# EAGLE design RPI4Soar_V1 (EAGLE 9.6.2)
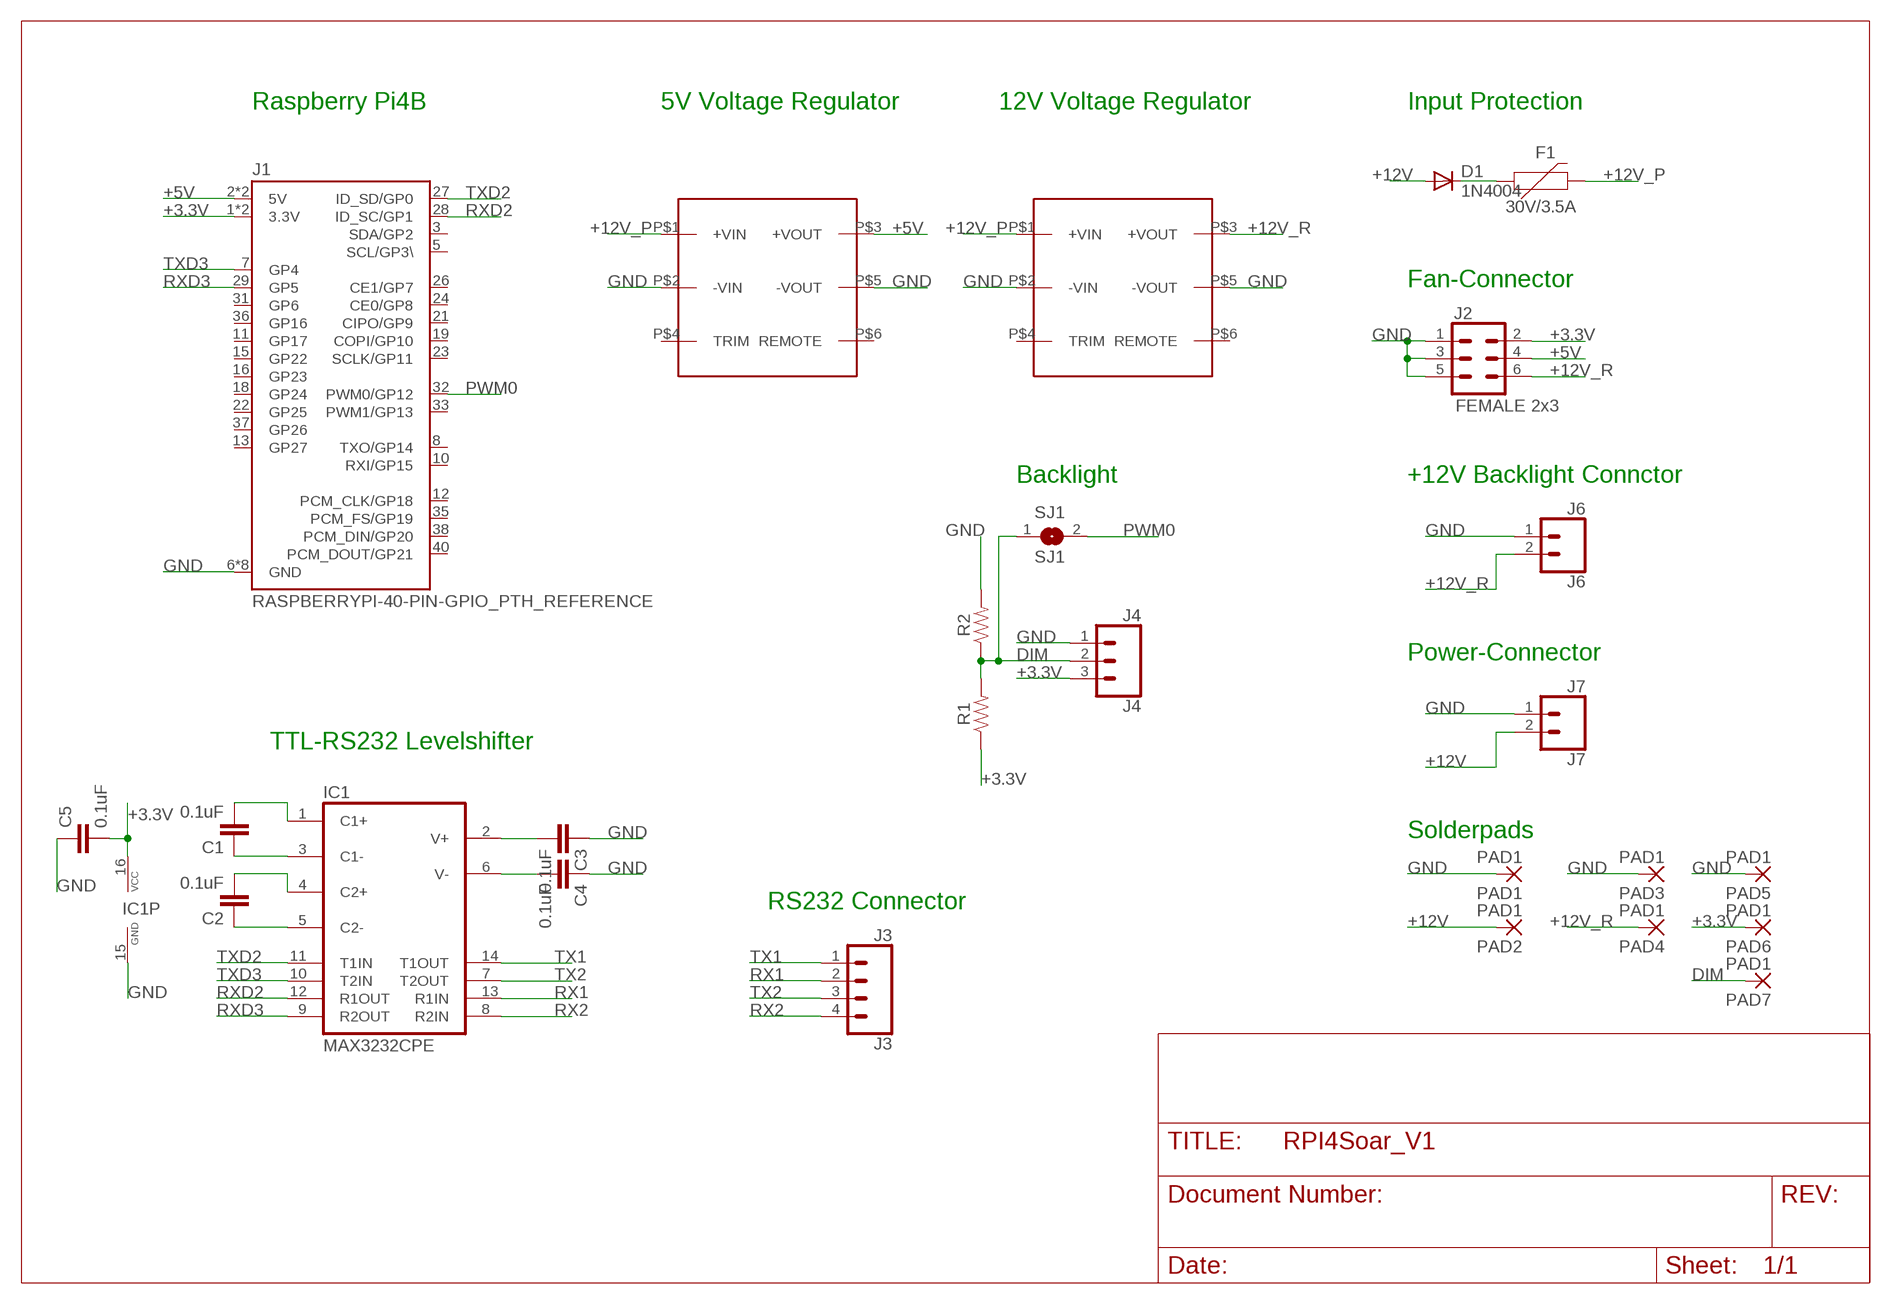
[diagram p0: schematic, sheet 1]

## Parts
C1  0.1uF  0.1UF-KIT-EZ-50V-20%  [CAP-PTH-SMALL-KIT]
C2  0.1uF  0.1UF-KIT-EZ-50V-20%  [CAP-PTH-SMALL-KIT]
C3  0.1uF  0.1UF-KIT-EZ-50V-20%  [CAP-PTH-SMALL-KIT]
C4  0.1uF  0.1UF-KIT-EZ-50V-20%  [CAP-PTH-SMALL-KIT]
C5  0.1uF  0.1UF-KIT-EZ-50V-20%  [CAP-PTH-SMALL-KIT]
D1  1N4004  [DO41-10]
F1  30V/3.5A  PPTC_PTH  [PTH]
IC1  MAX3232CPE  [DIL16]
J1  RASPBERRYPI-40-PIN-GPIO_PTH_REFERENCE  [RASPBERRY_PI_HAT_40_PIN_PTH_WITH_REFERNCE]
J2  FEMALE 2x3  CONN_03X2FEMALE  [2X3]
J3  J3  CONN_04PTH  [1X04]
J4  J4  CONN_03  [1X03]
J6  J6  CONN_02  [1X02]
J7  J7  CONN_02  [1X02]
PAD1  PAD1  SMD5  [SMD2,54-5,08]
PAD2  PAD1  SMD5  [SMD2,54-5,08]
PAD3  PAD1  SMD5  [SMD2,54-5,08]
PAD4  PAD1  SMD5  [SMD2,54-5,08]
PAD5  PAD1  SMD5  [SMD2,54-5,08]
PAD6  PAD1  SMD5  [SMD2,54-5,08]
PAD7  PAD1  SMD5  [SMD2,54-5,08]
R1  RESISTORAXIAL-0.3  [AXIAL-0.3]
R2  RESISTORAXIAL-0.3  [AXIAL-0.3]
SJ1  SJ1  SJ  [SJ]
U$1  TRACO_THN15WI +5V  TRACO_THN15WI  [TRACO_THN15WI]
U$2  TRACO_THN15WI +12V  TRACO_THN15WI  [TRACO_THN15WI]

## Nets
+3.3V: C5.2 IC1.16(VCC) J1.1(3.3V) J1.17(3.3V) J2.2 J4.3 PAD6.1(P) R1.P$1
+5V: J1.2(5V) J1.4(5V) J2.4 U$1.P$3(+VOUT)
+12V: D1.A J7.2 PAD2.1(P)
+12V_P: F1.P$2 U$1.P$1(+VIN) U$2.P$1(+VIN)
+12V_R: J2.6 J6.2 PAD4.1(P) U$2.P$3(+VOUT)
DIM: J4.2 PAD7.1(P) R1.P$2 R2.P$1 SJ1.1
GND: C3.1 C4.1 C5.1 IC1.15(GND) J1.6(GND) J1.9(GND) J1.14(GND) J1.20(GND) J1.25(GND) J1.30(GND) J1.34(GND) J1.39(GND) J2.1 J2.3 J2.5 J4.1 J6.1 J7.1 PAD1.1(P) PAD3.1(P) PAD5.1(P) R2.P$2 U$1.P$2(-VIN) U$1.P$5(-VOUT) U$2.P$2(-VIN) U$2.P$5(-VOUT)
N$2: D1.C F1.P$1
N$3: C2.1 IC1.5(C2-)
N$4: C2.2 IC1.4(C2+)
N$5: C1.1 IC1.3(C1-)
N$6: C1.2 IC1.1(C1+)
N$7: C3.2 IC1.2(V+)
N$8: C4.2 IC1.6(V-)
PWM0: J1.32(PWM0/GP12) SJ1.2
RX1: IC1.13(R1IN) J3.2
RX2: IC1.8(R2IN) J3.4
RXD2: IC1.12(R1OUT) J1.28(ID_SC/GP1)
RXD3: IC1.9(R2OUT) J1.29(GP5)
TX1: IC1.14(T1OUT) J3.1
TX2: IC1.7(T2OUT) J3.3
TXD2: IC1.11(T1IN) J1.27(ID_SD/GP0)
TXD3: IC1.10(T2IN) J1.7(GP4)
Unconnected: J1.3(SDA/GP2) J1.5(SCL/GP3\) J1.8(TXO/GP14) J1.10(RXI/GP15) J1.11(GP17) J1.12(PCM_CLK/GP18) J1.13(GP27) J1.15(GP22) J1.16(GP23) J1.18(GP24) J1.19(COPI/GP10) J1.21(CIPO/GP9) J1.22(GP25) J1.23(SCLK/GP11) J1.24(CE0/GP8) J1.26(CE1/GP7) J1.31(GP6) J1.33(PWM1/GP13) J1.35(PCM_FS/GP19) J1.36(GP16) J1.37(GP26) J1.38(PCM_DIN/GP20) J1.40(PCM_DOUT/GP21) U$1.P$4(TRIM) U$1.P$6(REMOTE) U$2.P$4(TRIM) U$2.P$6(REMOTE)

## Notes on the sheet
- Raspberry Pi4B | 5V Voltage Regulator | 12V Voltage Regulator | Input Protection
- Fan-Connector
- Backlight | +12V Backlight Connctor
- Power-Connector
- TTL-RS232 Levelshifter
- Solderpads
- RS232 Connector

## Library data of the parts
C1-C5 = SparkFun-Capacitors:0.1UF: 0.1µF ceramic capacitors A capacitor is a passive two-terminal electrical component used to store electrical energy temporarily in an electric field.; PROD_ID: CAP-08370
D1 = adafruit:1N4004: DIODE General purpose 1N400x type rectifier (With bigger pads) http://www.ladyada.net/library/pcb/eaglelibrary.html
F1 = SparkFun-Fuses:PPTC: Resettable Fuse PPTC Resettable Fuse. Really a sort of resistor with a polymeric positive temperature coefficient whose resistance increases dramatically with an increase in temperature. When heated by the power passing through the resistance rises causing the current to be limited, protecting the circuit. This is achieved by the transition of the polymer from a crystalline to an amorphous state where the conductive carbon separates breaking the conductive pathways found in the cool crystalline structure. When a PPTC cools back down it resumes conducting letting the circuit turn back on. SparkFun Products: SparkFun RedBoard - Programmed with Arduino <https://www.sparkfun.com/products/12757> Pro Micro - 5V/16MHz <https://www.sparkfun.com/products/12640> Arduino Pro 328 - 5V/16MHz <https://www.sparkfun.com/products/10915> MP3 Trigger <https://www.sparkfun.com/products/13720>; PROD_ID: RES-08490; VALUE: 72V/0.25A
IC1 = maxim:MAX3232*: True RS-232 Transceivers 3.0V to 5.5V, Low-Power up to 1Mbps, Using Four 0.1µF External Capacitors Source: http://pdfserv.maxim-ic.com/en/ds/MAX3222-MAX3241.pdf; MF: MAXIM; MPN: MAX3232CPE+; OC_FARNELL: 9724494; OC_NEWARK: 68K4626; SPICEPREFIX: X
J1 = SparkFun-Connectors:RASPBERRYPI-40-PIN-GPIO: Raspberry Pi GPIO Header 2x20 pin connector, as found on B, B+, A+ models. Both shrouded PTH and SMT versions available. SparkFun Products: GPIO Shrouded Header <https://www.sparkfun.com/products/13054>- PTH SparkFun Pi Wedge (Preassembled) <https://www.sparkfun.com/products/13717>
J2 = SparkFun-Connectors:CONN_03X2: Multi connection point. Often used as Generic Header-pin footprint for 0.1 inch spaced/style header connections You can populate with any combo of single row headers, but if you'd like an exact match, check these: Header - 2x3 (Male, 0.1") <https://www.sparkfun.com/products/12807> (PRT-12807) Header - 2x3 (Female, 0.1") <https://www.sparkfun.com/products/13010> (PRT-13010) 2x3 Pin Shrouded Header <https://www.sparkfun.com/products/10877> (PRT-10877) On any of the 0.1 inch spaced packages, you can populate with these: Break Away Headers - Straight <https://www.sparkfun.com/products/116> (PRT-00116) Break Away Male Headers - Right Angle <https://www.sparkfun.com/products/553> (PRT-00553) Female Headers <https://www.sparkfun.com/products/115> (PRT-00115) Break Away Headers - Machine Pin <https://www.sparkfun.com/products/117> (PRT-00117) Break Away Female Headers - Swiss Machine Pin <https://www.sparkfun.com/products/743> (PRT-00743) Special note: the shrouded connector mates well with our 3x2 ribbon cables: Ribbon Crimp Connector - 6-pin (2x3, Female) <https://www.sparkfun.com/products/10651> (PRT-10651) Ribbon Cable - 6 wire (15ft) <https://www.sparkfun.com/products/10646> (PRT-10646); PROD_ID: CONN-11566
J3 = SparkFun-Connectors:CONN_04: Multi connection point. Often used as Generic Header-pin footprint for 0.1 inch spaced/style header connections On any of the 0.1 inch spaced packages, you can populate with these: Break Away Headers - Straight <https://www.sparkfun.com/products/116> (PRT-00116) Break Away Male Headers - Right Angle <https://www.sparkfun.com/products/553> (PRT-00553) Female Headers <https://www.sparkfun.com/products/115> (PRT-00115) Break Away Headers - Machine Pin <https://www.sparkfun.com/products/117> (PRT-00117) Break Away Female Headers - Swiss Machine Pin <https://www.sparkfun.com/products/743> (PRT-00743) For SCREWTERMINALS and SPRING TERMINALS visit here: Screw Terimnals on SparkFun.com <https://www.sparkfun.com/search/results?term=Screw+Terminals> (5mm/3.5mm/2.54mm spacing) This device is also useful as a general connection point to wire up your design to another part of your project. Our various solder wires solder well into these plated through hole pads. Hook-Up Wire - Assortment (Stranded, 22 AWG) <https://www.sparkfun.com/products/11375> (PRT-11375) Hook-Up Wire - Assortment (Solid Core, 22 AWG) <https://www.sparkfun.com/products/11367> (PRT-11367) View the entire wire category on our website here <https://www.sparkfun.com/categories/141> Special notes: Molex polarized connector foot print use with SKU : PRT-08231 with associated crimp pins and housings. 1MM SMD Version SKU: PRT-10208; PROD_ID: CONN-09696
J4 = SparkFun-Connectors:CONN_03: Multi connection point. Often used as Generic Header-pin footprint for 0.1 inch spaced/style header connections On any of the 0.1 inch spaced packages, you can populate with these: Break Away Headers - Straight <https://www.sparkfun.com/products/116> (PRT-00116) Break Away Male Headers - Right Angle <https://www.sparkfun.com/products/553> (PRT-00553) Female Headers <https://www.sparkfun.com/products/115> (PRT-00115) Break Away Headers - Machine Pin <https://www.sparkfun.com/products/117> (PRT-00117) Break Away Female Headers - Swiss Machine Pin <https://www.sparkfun.com/products/743> (PRT-00743) Stackable Header - 3 Pin (Female, 0.1") <https://www.sparkfun.com/products/13875> (PRT-13875) For SCREWTERMINALS and SPRING TERMINALS visit here: Screw Terimnals on SparkFun.com <https://www.sparkfun.com/search/results?term=Screw+Terminals> (5mm/3.5mm/2.54mm spacing) This device is also useful as a general connection point to wire up your design to another part of your project. Our various solder wires solder well into these plated through hole pads. Hook-Up Wire - Assortment (Stranded, 22 AWG) <https://www.sparkfun.com/products/11375> (PRT-11375) Hook-Up Wire - Assortment (Solid Core, 22 AWG) <https://www.sparkfun.com/products/11367> (PRT-11367) View the entire wire category on our website here <https://www.sparkfun.com/categories/141> Special notes: Molex polarized connector foot print use with SKU : PRT-08232 with associated crimp pins and housings.; PROD_ID: XXX-00000; VALUE: 455-1750-1-ND
J6 J7 = SparkFun-Connectors:CONN_02: Multi connection point. Often used as Generic Header-pin footprint for 0.1 inch spaced/style header connections On any of the 0.1 inch spaced packages, you can populate with these: Break Away Headers - Straight <https://www.sparkfun.com/products/116> (PRT-00116) Break Away Male Headers - Right Angle <https://www.sparkfun.com/products/553> (PRT-00553) Female Headers <https://www.sparkfun.com/products/115> (PRT-00115) Break Away Headers - Machine Pin <https://www.sparkfun.com/products/117> (PRT-00117) Break Away Female Headers - Swiss Machine Pin <https://www.sparkfun.com/products/743> (PRT-00743) For SCREWTERMINALS and SPRING TERMINALS visit here: Screw Terimnals on SparkFun.com <https://www.sparkfun.com/search/results?term=Screw+Terminals> (5mm/3.5mm/2.54mm spacing) This device is also useful as a general connection point to wire up your design to another part of your project. Our various solder wires solder well into these plated through hole pads. Hook-Up Wire - Assortment (Stranded, 22 AWG) <https://www.sparkfun.com/products/11375> (PRT-11375) Hook-Up Wire - Assortment (Solid Core, 22 AWG) <https://www.sparkfun.com/products/11367> (PRT-11367) View the entire wire category on our website here <https://www.sparkfun.com/categories/141> Special notes: Molex polarized connector foot print use with: PRT-08233 with associated crimp pins and housings. 2.54_SCREWTERM for use with PRT-10571. 3.5mm Screw Terminal footprints for PRT-08084 5mm Screw Terminal footprints for use with PRT-08432
PAD1-PAD7 = wirepad:SMD5: SMD PAD
R1 R2 = SparkFun-Resistors:RESISTOR: Generic Resistor Package
SJ1 = jumper:SJ: SMD solder JUMPER
U$1 U$2 = rbe:TRACO_THN15WI

## Board
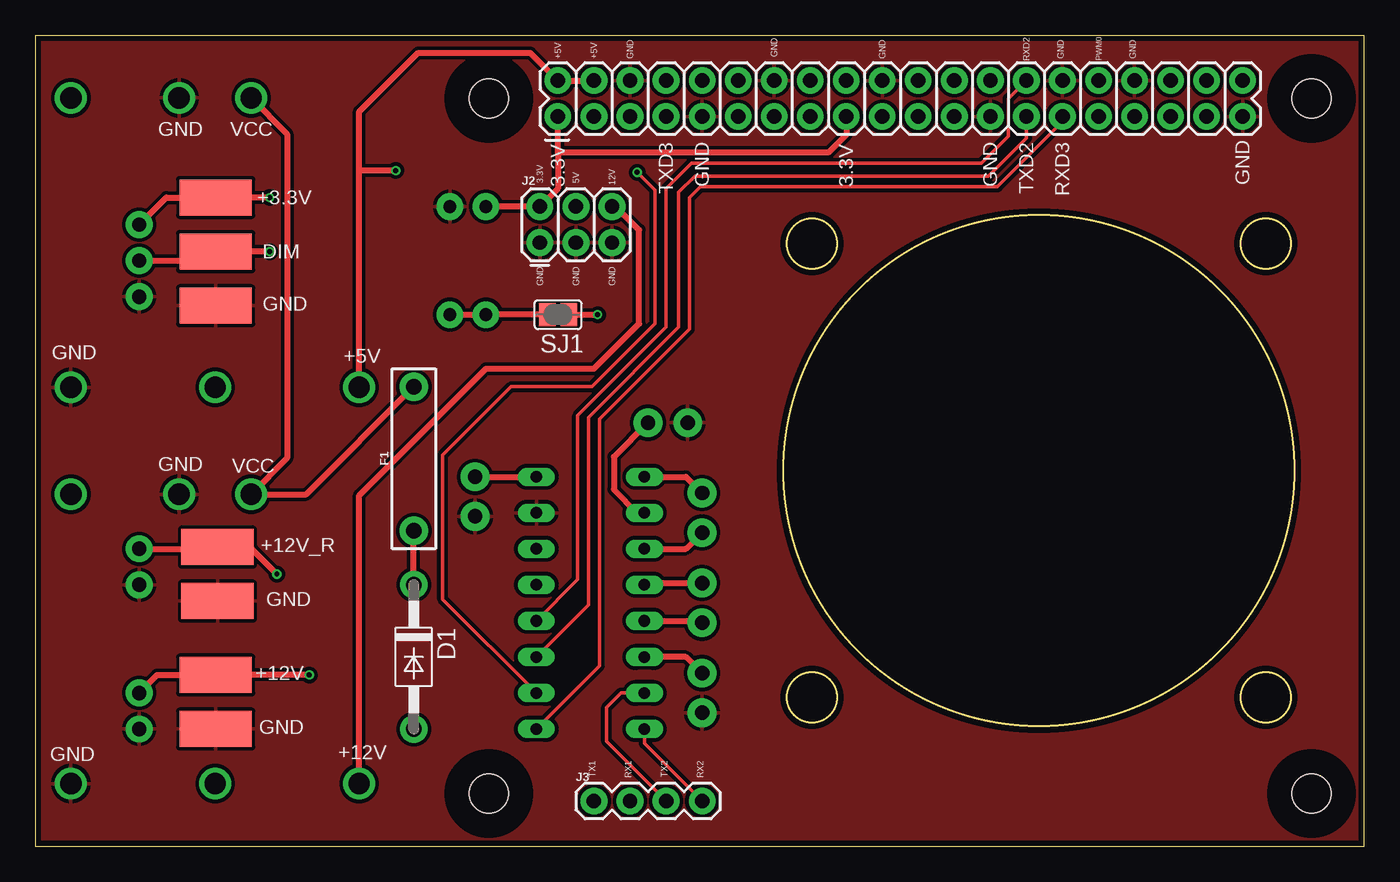
[diagram p1: board, top side]
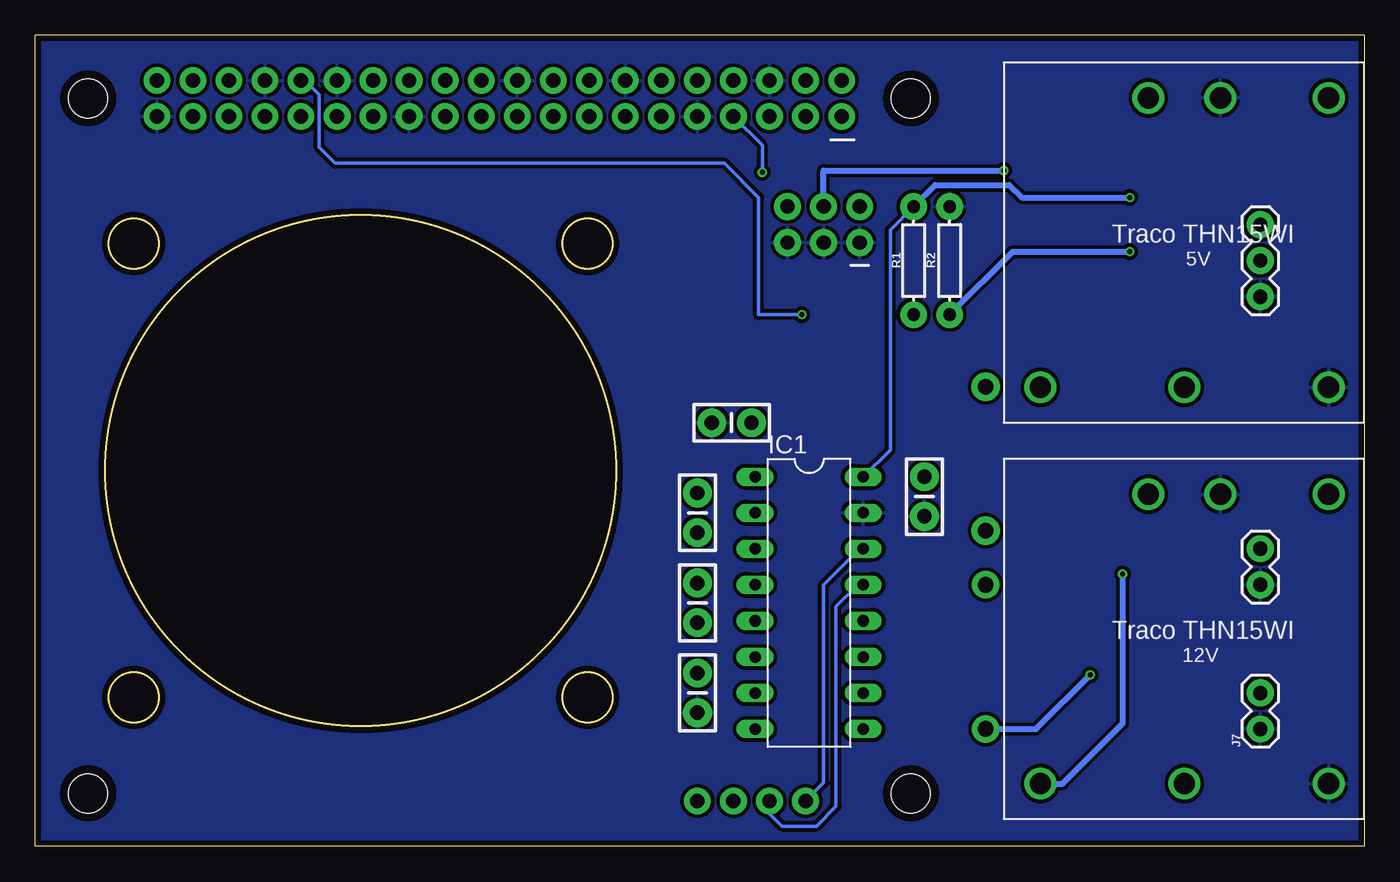
[diagram p2: board, bottom side, seen from below]

Size 93.65 x 57.15 mm. Coordinates in mm from the lower left corner, seen from the top.
Outline: 0,0 93.65,0 93.65,57.15 0,57.15 0,0
Outline: circle at 70.73,26.48 radius 18
Outline: circle at 86.73,10.47 radius 1.75
Outline: circle at 54.73,10.47 radius 1.75
Outline: circle at 86.73,42.48 radius 1.75
Outline: circle at 54.73,42.48 radius 1.75
Copper layers (1*16): Top 0.035mm / dielectric 1.5mm / Bottom 0.035mm
Design rules "NOA Eagle Rule 2016-06-12": minimum track width 6mil, minimum drill 0.3mm, track to track 6mil, track to pad 6mil, pad to pad 6mil, via to via 6mil, smd to smd 0mil, copper to edge 0.4mm, drill to drill 10mil, minimum pad ring 10mil, minimum via ring 6mil, stop-mask expansion 2mil, vias tented up to drill 25mil, thermal gap 10mil

### Footprints (pad centres in the part's own frame; a part is rotated, then mirrored left to right if it is on the bottom)
CAP-PTH-SMALL-KIT = drill 1.016 pad 2.032: 1 -1.397,0; 2 1.397,0
DO41-10 = drill 1.118 pad 1.93: A 5.08,0; C -5.08,0
PTH = drill 1.1 pad 2: P$1 -5.08,0; P$2 5.08,0
DIL16 = drill 0.813 long: 1 -8.89,-3.81; 2 -6.35,-3.81; 3 -3.81,-3.81; 4 -1.27,-3.81; 5 1.27,-3.81; 6 3.81,-3.81; 7 6.35,-3.81; 8 8.89,-3.81; 9 8.89,3.81; 10 6.35,3.81; 11 3.81,3.81; 12 1.27,3.81; 13 -1.27,3.81; 14 -3.81,3.81; 15 -6.35,3.81; 16 -8.89,3.81
RASPBERRY_PI_HAT_40_PIN_PTH_WITH_REFERNCE = drill 1.016 pad 1.88: 1 0,0; 2 0,2.54; 3 2.54,0; 4 2.54,2.54; 5 5.08,0; 6 5.08,2.54; 7 7.62,0; 8 7.62,2.54; 9 10.16,0; 10 10.16,2.54; 11 12.7,0; 12 12.7,2.54; 13 15.24,0; 14 15.24,2.54; 15 17.78,0; 16 17.78,2.54; 17 20.32,0; 18 20.32,2.54; 19 22.86,0; 20 22.86,2.54; 21 25.4,0; 22 25.4,2.54; 23 27.94,0; 24 27.94,2.54; 25 30.48,0; 26 30.48,2.54; 27 33.02,0; 28 33.02,2.54; 29 35.56,0; 30 35.56,2.54; 31 38.1,0; 32 38.1,2.54; 33 40.64,0; 34 40.64,2.54; 35 43.18,0; 36 43.18,2.54; 37 45.72,0; 38 45.72,2.54; 39 48.26,0; 40 48.26,2.54 | hole 2.75: -4.87,-47.727; 53.13,-47.727; 53.13,1.273; -4.87,1.273
2X3 = drill 1.016 pad 1.88: 1 0,0; 2 0,2.54; 3 2.54,0; 4 2.54,2.54; 5 5.08,0; 6 5.08,2.54
1X04 = drill 1.016 pad 1.88: 1 0,0; 2 2.54,0; 3 5.08,0; 4 7.62,0
1X03 = drill 1.016 pad 1.88: 1 0,0; 2 2.54,0; 3 5.08,0
1X02 = drill 1.016 pad 1.88: 1 0,0; 2 2.54,0
SMD2,54-5,08 = smd 2.54 x 5.08: 1 0,0
AXIAL-0.3 = drill 0.9 pad 1.88: P$1 -3.81,0; P$2 3.81,0
SJ = smd 1.168 x 1.6: 1 -0.762,0; 2 0.762,0
TRACO_THN15WI = drill 1.5: P$1 10.2,22.9; P$2 15.28,22.9; P$3 2.58,2.5; P$4 12.74,2.5; P$5 22.9,2.5; P$6 22.9,22.9

### Placement (x,y rotation side)
C1  46.99,23.5 90 bottom
C2  46.99,17.14 90 bottom
C3  44.58,29.84 0 bottom
C4  46.99,10.79 90 bottom
C5  30.99,24.64 90 bottom
D1  26.67,13.34 270 top
F1  26.67,27.3 90 top
IC1  39.12,17.14 270 bottom
J1  36.83,51.44 0 top
J2  35.56,42.55 0 top
J3  39.37,3.17 0 top
J4  7.31,38.73 90 bottom
J6  7.31,18.41 90 bottom
J7  7.31,8.26 90 bottom
PAD1  12.7,8.26 90 top
PAD2  12.7,12.06 90 top
PAD3  12.83,17.27 90 top
PAD4  12.83,21.08 90 top
PAD5  12.7,38.1 90 top
PAD6  12.7,45.72 90 top
PAD7  12.7,41.91 90 top
R1  31.75,41.27 270 bottom
R2  29.21,41.27 90 bottom
SJ1  36.83,37.47 0 top
U$1  25.4,29.84 0 bottom
U$2  25.4,1.91 0 bottom

### Tracks (layer width: path | path; a pad name or v marks a point on that pad's centre or on a via)
+3.3V  (via drill 0.35)
  Top 0.406: 36.83,48.9 36.83,46.35 J2.2 R1.P$1 | 36.83,48.9 J1.1 | J1.17 57.15,50.16 55.88,48.9 36.83,48.9 | C5.2 IC1.16 | J4.3 9.21,45.72 12.06,45.72 PAD6.1 v16.51,45.72
  Bottom 0.254: IC1.16 33.4,27.94 33.4,43.43 R1.P$1
  Bottom 0.406: R1.P$1 30.23,46.61 25.02,46.61 24.13,45.72 v16.51,45.72
+5V  (via drill 0.35)
  Top 0.406: J1.4 J1.2 34.87,55.93 26.98,55.93 22.82,51.78 22.82,47.62 | U$1.P$3 22.82,47.62 | v25.4,47.62 22.82,47.62
  Bottom 0.406: J2.4 38.1,47.62 v25.4,47.62
+12V  (via drill 0.35)
  Top 0.406: J7.2 8.58,12.06 PAD2.1 v19.3,12.06
  Bottom 0.406: D1.A 23.11,8.26 v19.3,12.06
+12V_P
  Top 0.406: U$1.P$1 17.74,50.2 17.74,27.34 U$2.P$1 19.09,24.8 F1.P$2
+12V_R  (via drill 0.35)
  Top 0.406: J2.6 40.89,45.09 42.55,43.43 42.55,36.83 39.37,33.66 31.75,33.66 22.82,24.73 U$2.P$3 | J6.2 12.7,20.95 | 12.7,20.95 PAD4.1 | v17.02,19.18 15.24,20.95 12.7,20.95
  Bottom 0.406: U$2.P$3 21.25,4.41 17.02,8.64 v17.02,19.18
DIM  (via drill 0.35)
  Top 0.406: R2.P$1 R1.P$2 SJ1.1 | J4.2 11.43,41.27 | 11.43,41.27 12.06,41.27 PAD7.1 | v16.51,41.91 12.06,41.91 11.43,41.27
  Bottom 0.406: R2.P$1 24.77,41.91 v16.51,41.91
GND
  pour Top (isolate 0.254): -1.27,58.42 95.25,58.42 95.25,-1.27 -1.27,-1.27
  pour Bottom (isolate 0.254): -1.27,58.42 -1.27,-1.27 95.25,-1.27 95.25,58.42
N$2
  Top 0.406: D1.C F1.P$1
N$3
  Top 0.406: IC1.5 46.86,15.88 C2.1
N$4
  Top 0.406: IC1.4 43.05,18.54 C2.2
N$5
  Top 0.406: IC1.3 45.85,20.95 C1.1
N$6
  Top 0.406: IC1.1 45.85,26.04 C1.2
N$7
  Top 0.406: C3.2 40.77,27.43 40.77,25.15 42.42,23.5 IC1.2
N$8
  Top 0.406: C4.2 45.85,13.34 IC1.6
PWM0  (via drill 0.35)
  Top 0.406: SJ1.2 v39.62,37.47
  Bottom 0.254: v39.62,37.47 42.67,37.47 42.67,45.72 45.09,48.13 72.52,48.13 73.66,49.28 73.66,52.96 74.68,53.98 J1.32
RX1
  Bottom 0.254: J3.2 41.91,2.29 41.02,1.4 38.61,1.4 37.21,2.79 37.21,16.89 35.69,18.41 IC1.13
RX2
  Top 0.254: J3.4 42.93,7.24 IC1.8
RXD2
  Top 0.254: IC1.12 38.23,18.8 38.23,30.35 44.45,36.58 44.45,46.35 46.23,48.13 66.67,48.13 68.58,50.04 68.58,52.7 J1.28
RXD3
  Top 0.254: IC1.9 39.75,12.7 39.75,30.1 46.1,36.45 46.1,45.72 46.86,46.48 67.82,46.48 72.39,51.05 J1.29
TX1
  Bottom 0.254: J3.1 38.1,4.45 38.1,18.41 35.56,20.95 IC1.14
TX2
  Top 0.254: J3.3 40.26,7.37 40.26,9.78 41.27,10.79 IC1.7
TXD2
  Top 0.254: IC1.11 38.99,17.02 38.99,30.23 45.34,36.58 45.34,46.1 46.48,47.24 67.18,47.24 69.85,49.91 J1.27
TXD3  (via drill 0.35)
  Top 0.254: IC1.10 28.7,17.4 28.7,27.56 33.53,32.38 39.24,32.38 43.69,36.83 43.69,46.23 v42.42,47.5
  Bottom 0.254: v42.42,47.5 42.42,49.4 J1.7

### Text on the board
tNames: GND | +5V | +5V | GND | GND | RXD2 | GND | PWM0 | GND | GND | VCC | 3.3V | 5V | 12V | GND | 3.3V | TXD3 | GND | 3.3V | GND | TXD2 | RXD3 | +3.3V | DIM | GND | GND | GND | GND | GND | +5V | GND | VCC | +12V_R | GND | +12V | GND | GND | +12V | TX1 | RX1 | TX2 | RX2
bNames: 5V | 12V